# EAGLE design temp-sensor (EAGLE 8.6.0)
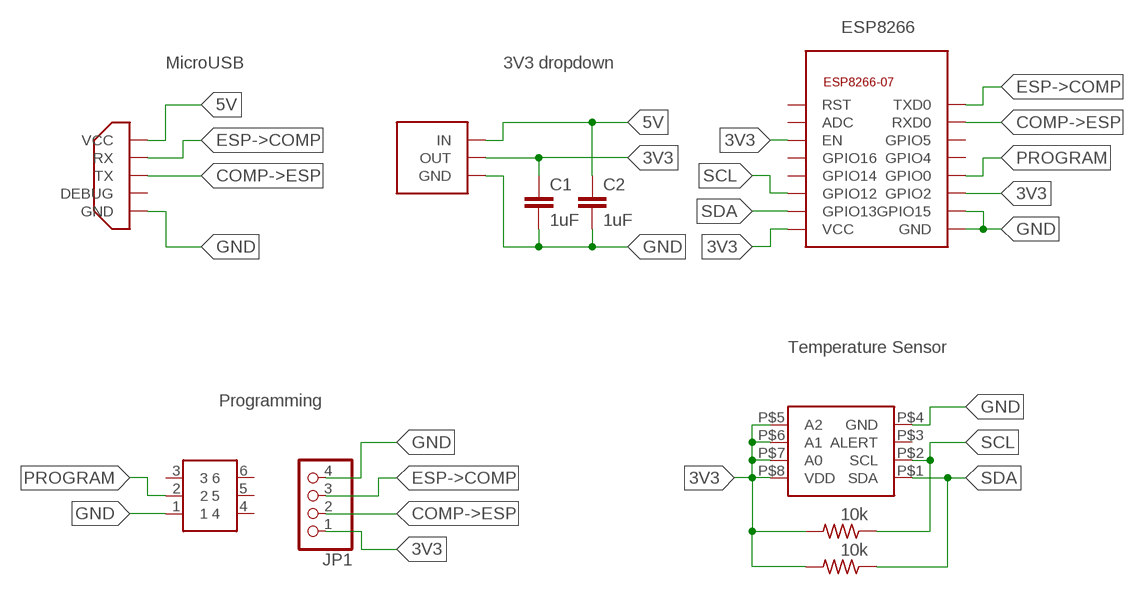
[diagram p0: schematic, sheet 1]

## Parts
C1  1uF  C-EUC0805  [C0805]
C2  1uF  C-EUC0805  [C0805]
JP1  PINHD-1X4  [1X04]
R1  10k  R-US_M0805  [M0805]
R2  10k  R-US_M0805  [M0805]
U$1  MCP9808  [MSOP-8]
U$2  ESP8266-12E-SMD  [ESP8266-12E-SMD]
U$3  MICROUSB609-4613-1-ND  [MICROUSB]
U$4  AZ1117E  [SOT-223]
U$5  AYZ0202AGRL  [AYZ0202AGRL]

## Nets
3V3: C1.1 JP1.1 R1.2 R2.2 U$1.P$5(A2) U$1.P$6(A1) U$1.P$7(A0) U$1.P$8(VDD) U$2.EN U$2.GPIO2 U$2.VCC U$4.P$1(OUT) U$4.P$2(OUT)
5V: C2.1 U$3.VCC U$4.P$4(IN)
COMP->ESP: JP1.2 U$2.RXD0 U$3.TX
ESP->COMP: JP1.3 U$2.TXD0 U$3.RX
GND: C1.2 C2.2 JP1.4 U$1.P$4(GND) U$2.GND U$2.GPIO15 U$3.GND U$4.P$3(GND) U$5.1
PROGRAM: U$2.GPIO0 U$5.2
SCL: R2.1 U$1.P$2(SCL) U$2.GPIO12
SDA: R1.1 U$1.P$1(SDA) U$2.GPIO13
Unconnected: U$1.P$3(ALERT) U$2.ADC U$2.GPIO4 U$2.GPIO5 U$2.GPIO14 U$2.GPIO16 U$2.RST U$3.DEBUG U$5.3 U$5.4 U$5.5 U$5.6

## Notes on the sheet
- ESP8266
- MicroUSB | 3V3 dropdown
- Temperature Sensor
- Programming

## Library data of the parts
C1 C2 = rcl:C-EU: CAPACITOR, European symbol; SPICEPREFIX: C
JP1 = pinhead:PINHD-1X4: PIN HEADER
R1 R2 = rcl:R-US_: RESISTOR, American symbol; SPICEPREFIX: R
U$1 = idiotic-sensors:MCP9808
U$2 = idiotic-microcontrollers:ESP8266
U$3 = idiotic-connectors:MICROUSB
U$4 = idiotic-regulators:AZ1117E: AZ1117E - 3.3 volt regulator Technical Specifications: Max Current 1.3 A Connect 1.0 uF cap from GND to IN Connect 1.0 uF cap from GND to OUT
U$5 = idiotic-switches:AYZ0202AGRL

## Board
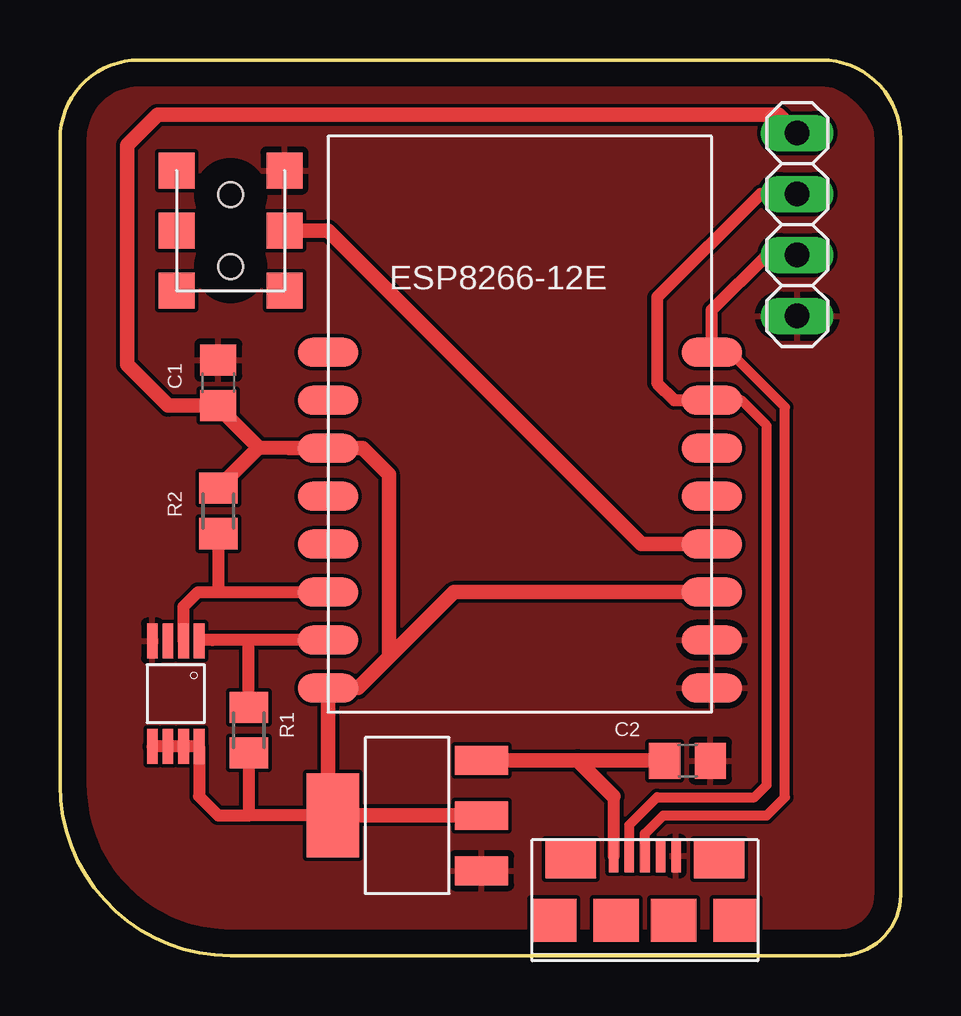
[diagram p1: board, top side]
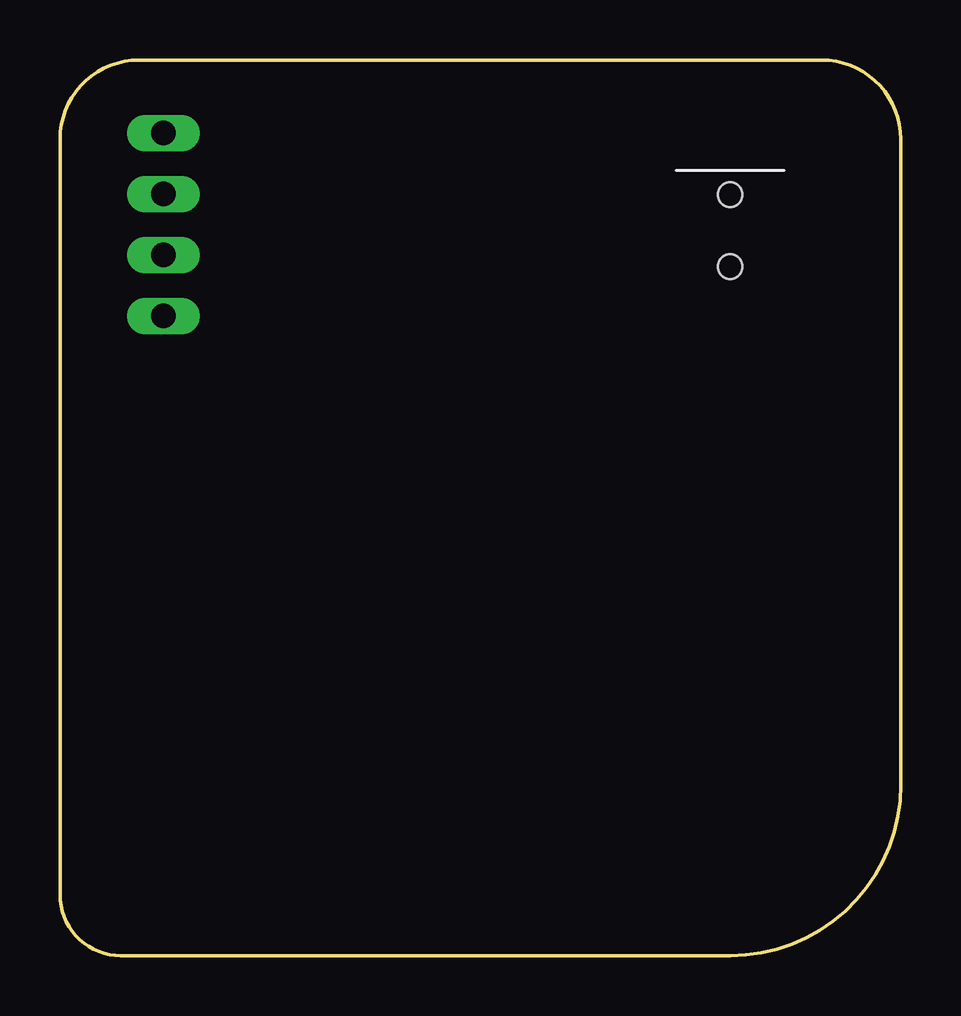
[diagram p2: board, bottom side, seen from below]

Size 35.05 x 37.34 mm. Coordinates in mm from the lower left corner, seen from the top.
Outline: 7.11,0 arc-90 0,7.11 0,34.04 arc-90 3.3,37.34 31.75,37.34 arc-90 35.05,34.04 35.05,2.54 arc-90 32.51,0 7.11,0
Copper layers (1*16): Top 0.035mm / dielectric 1.5mm / Bottom 0.035mm
Design rules "default": minimum track width 6mil, minimum drill 0.35mm, track to track 6mil, track to pad 6mil, pad to pad 6mil, via to via 6mil, smd to smd 6mil, copper to edge 40mil, drill to drill 6mil, minimum pad ring 10mil, minimum via ring 8mil, stop-mask expansion 4mil, vias tented up to drill 0mil, thermal gap 10mil

### Footprints (pad centres in the part's own frame; a part is rotated, then mirrored left to right if it is on the bottom)
C0805 = smd 1.3 x 1.5: 1 -0.95,0; 2 0.95,0
1X04 = drill 1.016 long: 1 -3.81,0; 2 -1.27,0; 3 1.27,0; 4 3.81,0
M0805 = smd 1.3 x 1.6: 1 -0.95,0; 2 0.95,0
MSOP-8 = smd 1.45 x 0.45: P$1 -2.2,0.975; P$2 -2.2,0.325; P$3 -2.2,-0.325; P$4 -2.2,-0.975; P$5 2.2,-0.975; P$6 2.2,-0.325; P$7 2.2,0.325; P$8 2.2,0.975
ESP8266-12E-SMD = smd 2.5 x 1.2: ADC 0,13; EN 0,11; GND 16,1; GPIO0 16,7; GPIO2 16,5; GPIO4 16,9; GPIO5 16,11; GPIO12 0,5; GPIO13 0,3; GPIO14 0,7; GPIO15 16,3; GPIO16 0,9; RST 0,15; RXD0 16,13; TXD0 16,15; VCC 0,1
MICROUSB = smd 0.4 x 1.35: DEBUG -0.65,0.675; GND -1.3,0.675; RX 0,0.675; TX 0.65,0.675; VCC 1.3,0.675 | smd 2.1 x 1.6: P$1 3.1,0.8; P$6 -3.1,0.8 | smd 1.9 x 1.8: P$2 3.8,3.35; P$3 -3.8,3.35; P$5 -1.2,3.35; P$7 1.2,3.35
SOT-223 = smd 3.5 x 2.2: P$1 0,3.1 | smd 1.2 x 2.2: P$2 0,-3.1; P$3 -2.3,-3.1; P$4 2.3,-3.1
AYZ0202AGRL = smd 1.5 x 1.5: 1 -2.5,2.25; 2 0,2.25; 3 2.5,2.25; 4 -2.5,-2.25; 5 0,-2.25; 6 2.5,-2.25 | hole 1.016: -1.5,0; 1.5,0

### Placement (x,y rotation side)
C1  6.6,23.88 90 top
C2  26.16,8.13 0 top
JP1  30.73,30.48 270 top
R1  7.87,9.4 270 top
R2  6.6,18.54 90 top
U$1  4.83,10.92 270 top
U$2  11.18,10.16 0 top
U$3  24.38,4.83 180 top
U$4  14.48,5.84 90 top
U$5  7.11,30.23 270 top

### Tracks (layer width: path | path; a pad name or v marks a point on that pad's centre or on a via)
3V3
  Top 0.508: U$4.P$1 7.87,5.84 | 7.87,5.84 6.6,5.84 5.8,6.64 U$1.P$8 U$1.P$7 U$1.P$6 U$1.P$5 | R1.2 7.87,5.84
  Top 0.61: 13.72,12.45 12.43,11.16 U$2.VCC 11.18,6.04 U$4.P$1 U$4.P$2 | 13.72,12.45 13.72,20.07 12.62,21.16 U$2.EN 9.54,21.16 8.29,21.18 | U$2.GPIO2 16.43,15.16 13.72,12.45 | R2.2 8.29,21.18 | 8.29,21.18 6.6,22.86 C1.1 4.51,22.93 2.79,24.64 2.79,33.78 4.06,35.05 29.97,35.05 JP1.1
5V
  Top 0.508: U$3.VCC 23.08,6.63 23.08,6.64
  Top 0.61: U$4.P$4 21.58,8.14 | 23.08,6.64 21.58,8.14 | 21.58,8.14 25.2,8.14 C2.1
COMP->ESP
  Top 0.406: U$3.TX 23.73,5.45 24.89,6.6 28.96,6.6 29.46,7.11 29.46,22.1 28.4,23.16 U$2.RXD0
  Top 0.508: U$2.RXD0 25.61,23.16 24.89,23.88 24.89,27.43 29.21,31.75 JP1.2
ESP->COMP
  Top 0.406: U$3.RX 24.38,5.08 25.15,5.84 29.46,5.84 30.23,6.6 30.23,22.86 27.93,25.16 U$2.TXD0
  Top 0.508: U$2.TXD0 27.18,26.92 29.46,29.21 JP1.3
GND
  pour Top: 1.02,33.53 1.02,7.87 arc90 7.11,1.02 32.26,1.02 arc90 34.04,2.79 34.04,33.27 arc90 31.24,36.32 3.81,36.58 arc90
PROGRAM
  Top 0.61: U$5.2 11.18,30.23 24.24,17.16 U$2.GPIO0
SCL
  Top 0.508: 6.6,15.16 5.76,15.16 5.15,14.55 U$1.P$2 | 6.6,15.16 U$2.GPIO12 | R2.1 6.6,15.16
SDA
  Top 0.152: 6.35,13.16 6.31,13.12 U$1.P$1
  Top 0.508: U$2.GPIO13 7.87,13.16 | 7.87,13.16 6.35,13.16 5.87,13.16 | R1.1 7.87,13.16